# Altium schematic sheet MKE1xFxxxVLH.SchDoc
size A; Organization: Cal Poly Racing; engineer1: who?
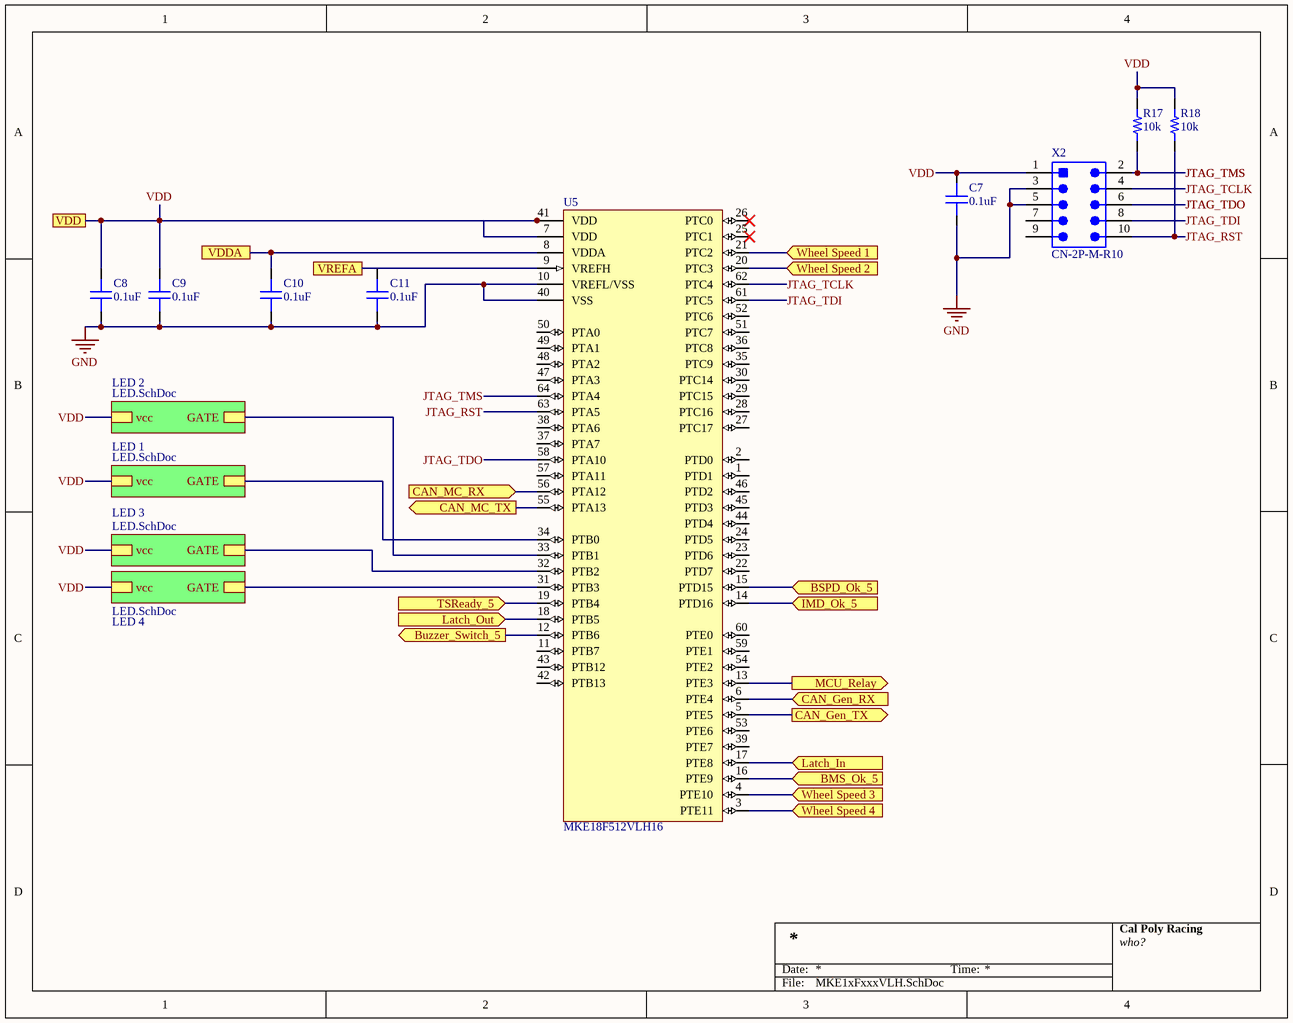
[diagram p0: MKE1xFxxxVLH.SchDoc]

## Parts
C7  capacitance: 0.1uF  [0603]  (hidden comment: capacitor)
C8  capacitance: 0.1uF  [0603]  (hidden comment: capacitor)
C9  capacitance: 0.1uF  [0603]  (hidden comment: capacitor)
C10  capacitance: 0.1uF  [0603]  (hidden comment: capacitor)
C11  capacitance: 0.1uF  [0603]  (hidden comment: capacitor)
R17  10k  [RES 0603/1608]
R18  10k  [RES 0603/1608]
U5  MKE18F512VLH16  [TQFP64]
X2  CN-2P-M-R10  [HDR2X5_SMT]

## Sub-sheets
LED 1 = LED.SchDoc: GATE, vcc
LED 2 = LED.SchDoc: GATE, vcc
LED 3 = LED.SchDoc: GATE, vcc
LED 4 = LED.SchDoc: GATE, vcc

## Ports
BMS_Ok_5 (in), BSPD_Ok_5 (in), Buzzer_Switch_5 (out), CAN_Gen_RX (in), CAN_Gen_TX (out), CAN_MC_RX (in), CAN_MC_TX (out), IMD_Ok_5 (in), Latch_In (in), Latch_Out (in), MCU_Relay (out), TSReady_5 (in), VDD, VDDA, VREFA, Wheel Speed 1 (in), Wheel Speed 2 (in), Wheel Speed 3 (in), Wheel Speed 4 (in)

## Nets
GND: C7.1 C8.1 C9.1 C10.1 C11.1 U5.10(VREFL/VSS) U5.40(VSS) X2.3 X2.5
BMS_Ok_5: U5.16(PTE9) ; port BMS_Ok_5
BSPD_Ok_5: U5.15(PTD15) ; port BSPD_Ok_5
Buzzer_Switch_5: U5.12(PTB6) ; port Buzzer_Switch_5
CAN_Gen_RX: U5.6(PTE4) ; port CAN_Gen_RX
CAN_Gen_TX: U5.5(PTE5) ; port CAN_Gen_TX
CAN_MC_RX: U5.56(PTA12) ; port CAN_MC_RX
CAN_MC_TX: U5.55(PTA13) ; port CAN_MC_TX
IMD_Ok_5: U5.14(PTD16) ; port IMD_Ok_5
JTAG_RST: R18.1 U5.63(PTA5) X2.10
JTAG_TCLK: U5.62(PTC4) X2.4
JTAG_TDI: U5.61(PTC5) X2.8
JTAG_TDO: U5.58(PTA10) X2.6
JTAG_TMS: R17.1 U5.64(PTA4) X2.2
Latch_In: U5.17(PTE8) ; port Latch_In
Latch_Out: U5.18(PTB5) ; port Latch_Out
MCU_Relay: U5.13(PTE3) ; port MCU_Relay
TSReady_5: U5.19(PTB4) ; port TSReady_5
VDD: C7.2 C8.2 C9.2 R17.2 R18.2 U5.7(VDD) U5.41(VDD) X2.1 ; port VDD, sheet LED 1/vcc, sheet LED 3/vcc, sheet LED 4/vcc, sheet LED 2/vcc
VDDA: C10.2 U5.8(VDDA) ; port VDDA
VREFA: C11.2 U5.9(VREFH) ; port VREFA
Wheel Speed 1: U5.21(PTC2) ; port Wheel Speed 1
Wheel Speed 2: U5.20(PTC3) ; port Wheel Speed 2
Wheel Speed 3: U5.4(PTE10) ; port Wheel Speed 3
Wheel Speed 4: U5.3(PTE11) ; port Wheel Speed 4
NetU5_31: U5.31(PTB3) ; sheet LED 4/GATE
NetU5_32: U5.32(PTB2) ; sheet LED 3/GATE
NetU5_33: U5.33(PTB1) ; sheet LED 2/GATE
NetU5_34: U5.34(PTB0) ; sheet LED 1/GATE

Not connected (* = marked no-connect by the designer): U5 1(PTD1) 2(PTD0) 11(PTB7) 22(PTD7) 23(PTD6) 24(PTD5) 25(PTC1)* 26(PTC0)* 27(PTC17) 28(PTC16) 29(PTC15) 30(PTC14) 35(PTC9) 36(PTC8) 37(PTA7) 38(PTA6) 39(PTE7) 42(PTB13) 43(PTB12) 44(PTD4) 45(PTD3) 46(PTD2) 47(PTA3) 48(PTA2) 49(PTA1) 50(PTA0) 51(PTC7) 52(PTC6) 53(PTE6) 54(PTE2) 57(PTA11) 59(PTE1) 60(PTE0); X2 7 9

## Notes on the sheet
- Date:
- Time:
- File:

## Library data of the parts
C7-C11 = 1: Generic 0603 capacitor; id: 1; voltage: 50; dielectric: Ceramic; percent tolerance: 10; Name: 0603 Capacitor; ESR: 1; package: 0603; quantity: 0
R17 R18 = 1: id: 1; name: 0603 Resistor; percent tolerance: 5; resistance: 10k; package: 0603; quantity: 0
U5 = 1: 32b NXP Microcontroller; id: 1; voltagemin: 2.70000004768372; voltagemax: 5.5; name: MKE18F512VLH16; package: TQFP64; quantity: 0
X2 = 4: CONN_TE_2X5POS; id: 4; Name: 5103309-1; numcontacts: 10; numrows: 2; pitch: 2.54mm; MfrPartNo: *; link: https://www.digikey.com/product-detail/en/5103309-1/A33160-ND/1114898?utm_campaign=buynow&WT.z_cid=ref_octopart_dkc_buynow&utm_medium=aggregator&curr=usd&site=us&utm_source=octopart; quantity: 0